# EAGLE design flow_sensor (EAGLE 8.4.3)

## Sheet 1 of 2
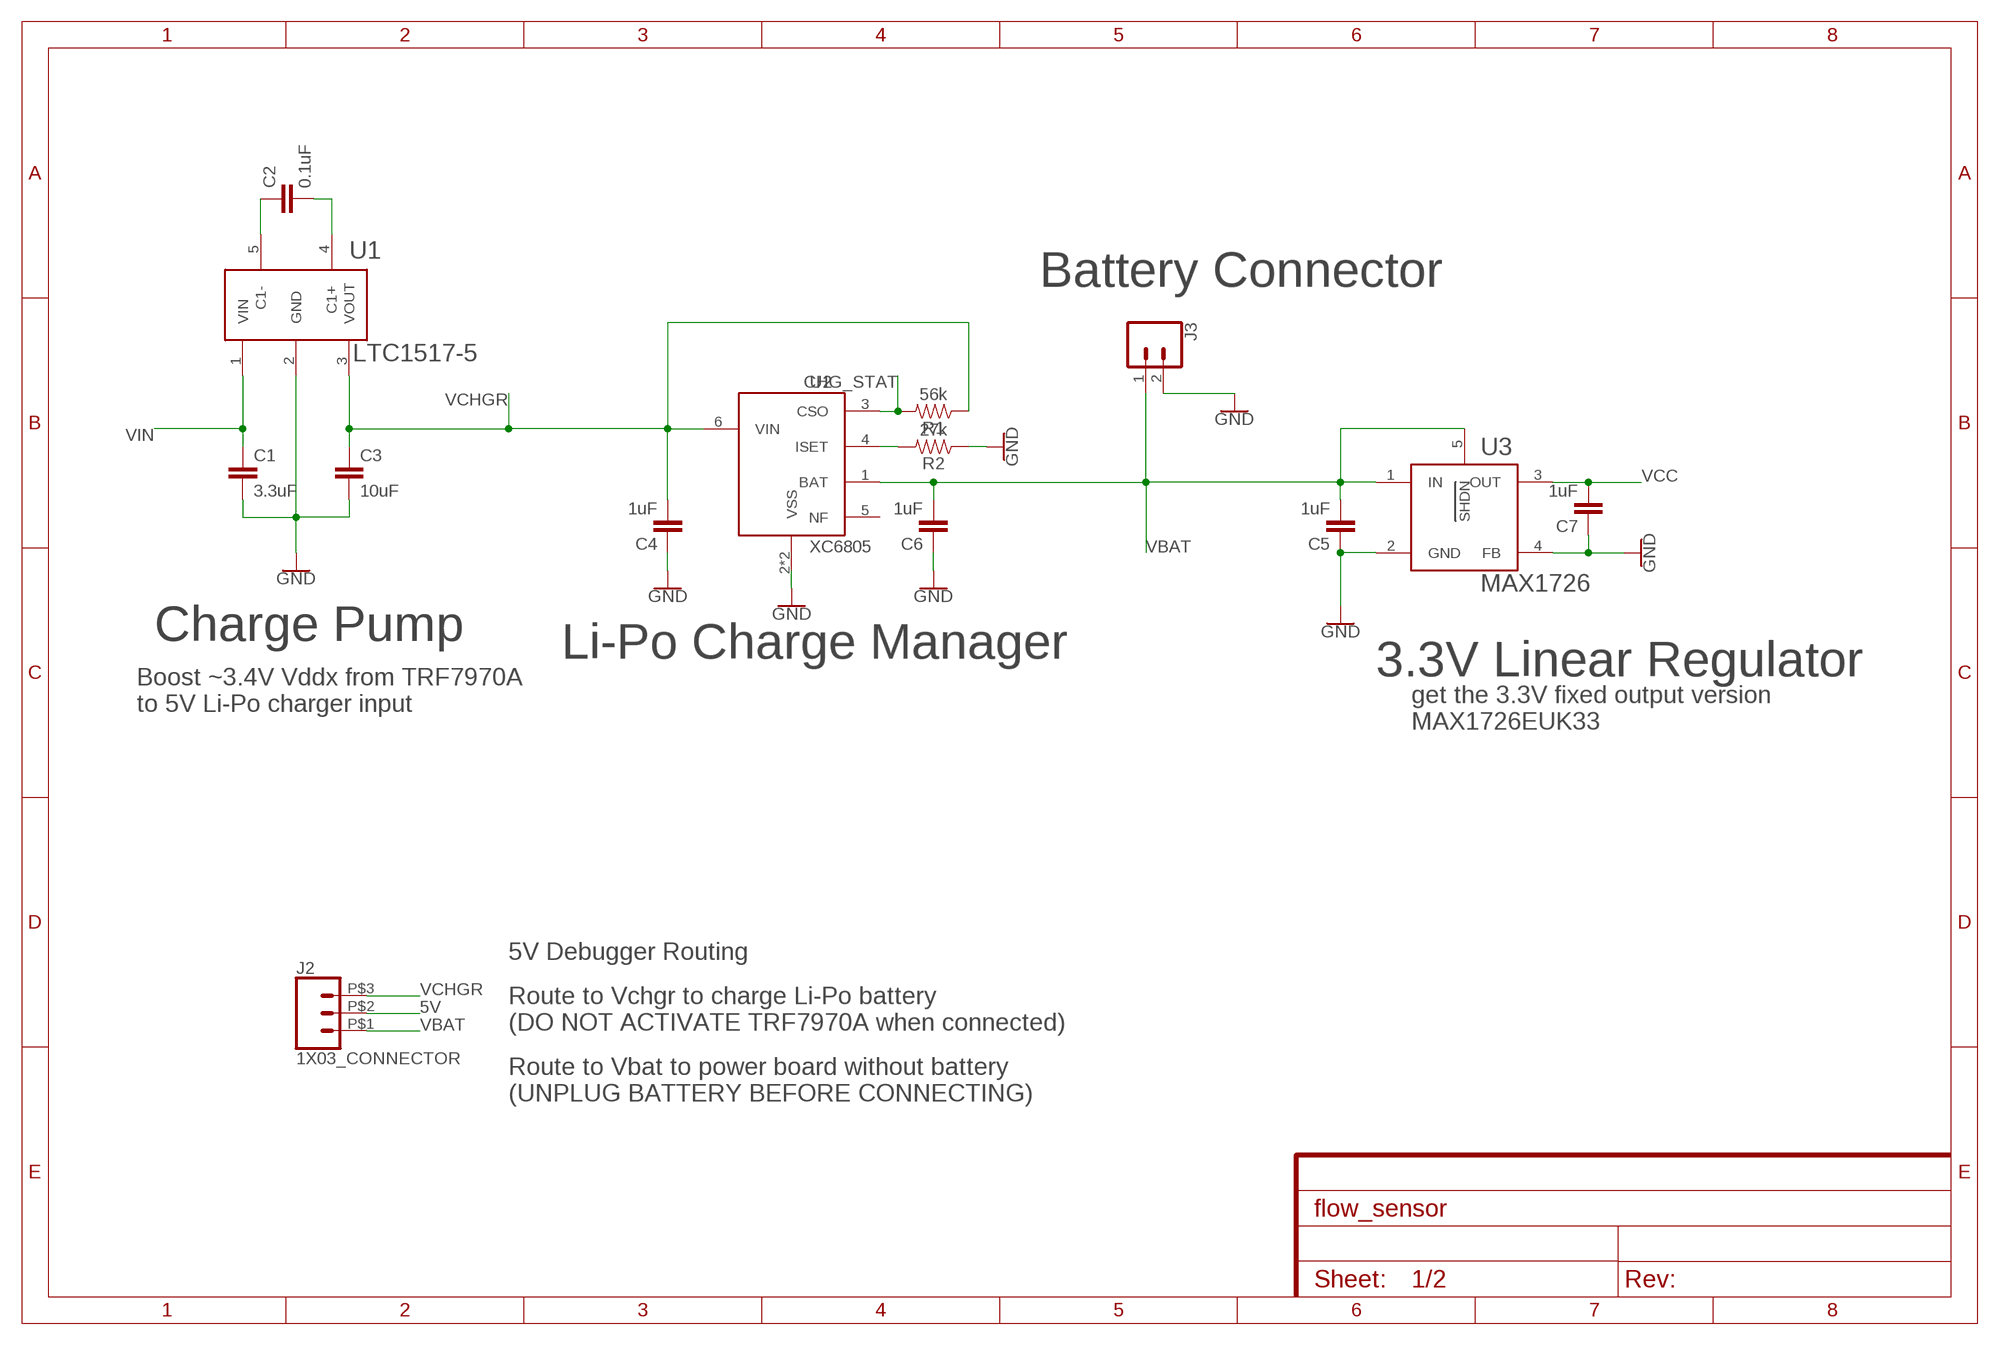
[diagram p0: schematic, sheet 1, part 1 of 2]
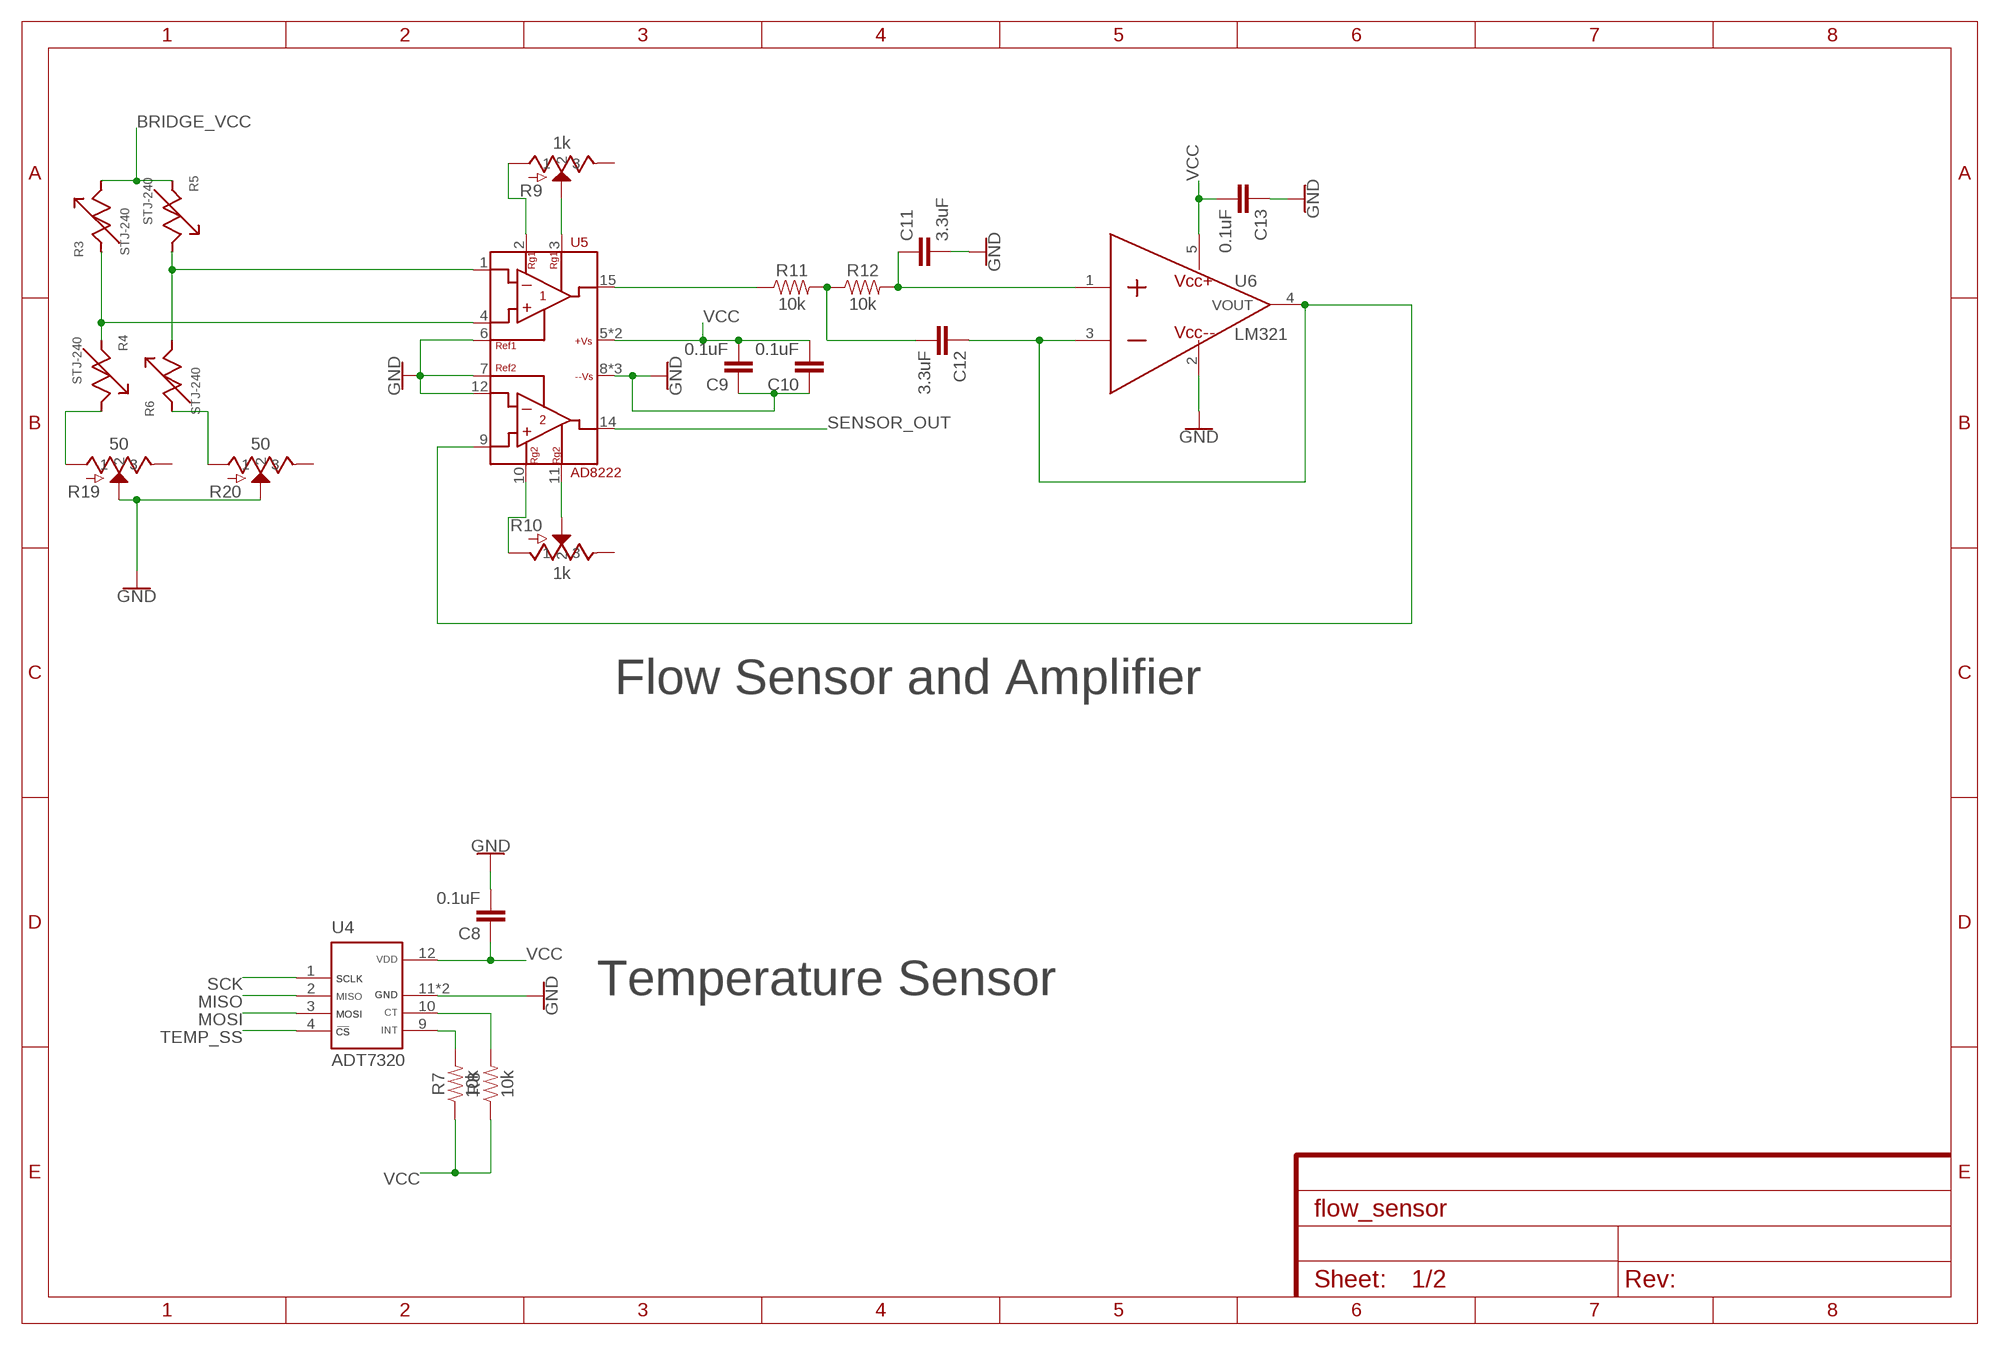
[diagram p1: schematic, sheet 1, part 2 of 2]
FRAME1 (FRAME-A4L): CNAME: Power Supply; DESIGNER: A Osborn, M Silvern, N Yokley
FRAME2 (FRAME-A4L): CNAME: Sensor; DESIGNER: A Osborn, M Silvern, N Yokley

### Parts
C1  3.3uF  CAPACITOR_NONPOLARIZED  [0603]
C2  0.1uF  CAPACITOR_NONPOLARIZED  [0603]
C3  10uF  CAPACITOR_NONPOLARIZED  [0603]
C4  1uF  CAPACITOR_NONPOLARIZED  [0603]
C5  1uF  CAPACITOR_NONPOLARIZED  [0603]
C6  1uF  CAPACITOR_NONPOLARIZED  [0603]
C7  1uF  CAPACITOR_NONPOLARIZED  [0603]
C8  0.1uF  CAPACITOR_NONPOLARIZED  [0603]
C9  0.1uF  CAPACITOR_NONPOLARIZED  [0603]
C10  0.1uF  CAPACITOR_NONPOLARIZED  [0603]
C11  3.3uF  CAPACITOR_NONPOLARIZED  [0603]
C12  3.3uF  CAPACITOR_NONPOLARIZED  [0603]
C13  0.1uF  CAPACITOR_NONPOLARIZED  [0603]
J2  1X03_CONNECTOR  [1X03_SMD_HEADER]
J3  CONN_021X02_NO_SILK  [1X02_NO_SILK]
R1  56k  RESISTOR  [0603]
R2  27k  RESISTOR  [0603]
R3  STJ-240  [SOIC-8-NOCREAM]
R4  STJ-240  [SOIC-8-NOCREAM]
R5  STJ-240  [SOIC-8-NOCREAM]
R6  STJ-240  [SOIC-8-NOCREAM]
R7  10k  RESISTOR  [0603]
R8  10k  RESISTOR  [0603]
R9  1k  ST-32ETA  [ST-32ETA]
R10  1k  ST-32ETA  [ST-32ETA]
R11  10k  RESISTOR  [0603]
R12  10k  RESISTOR  [0603]
R19  50  ST-32ETA  [ST-32ETA]
R20  50  ST-32ETA  [ST-32ETA]
U1  LTC1517-5  [SOT-23-5]
U2  XC6805  [DFN6-1.8X2.0]
U3  MAX1726  [SOT-23-5]
U4  ADT7320  [QFN16-4X4]
U5  AD8222  [QFN16-4X4]
U6  LM321  [SOT-23-5]

### Nets
5V: J2.P$2 ; also sheet 2
BRIDGE_VCC: R3.8 R5.1 ; also sheet 2
CHG_STAT: R1.2 U2.3(CSO) ; also sheet 2
GND: C1.2 C3.2 C4.1 C5.1 C6.1 C7.1 C8.2 C9.1 C10.1 C11.2 C13.1 J3.2 R2.1 R19.2 R20.2 U1.2(GND) U2.2(VSS) U2.PAD(VSS) U3.2(GND) U3.4(FB) U4.11(GND) U4.EXP(GND) U5.6(REF1) U5.7(REF2) U5.8(-VS) U5.12(-IN2) U5.13(-VS) U5.EXP(-VS) U6.2(VCC-) ; also sheet 2
MISO: U4.2(MISO) ; also sheet 2
MOSI: U4.3(MOSI) ; also sheet 2
N$2: C2.1 U1.5(C1-)
N$3: C2.2 U1.4(C1+)
N$5: R4.8 R19.1
N$6: R7.2 U4.9(INT)
N$7: R6.1 R20.1
N$17: R10.1 U5.10(RG2)
N$18: R3.1 R4.1 U5.4(+IN1)
N$19: C11.1 R12.2 U6.1(IN+)
N$21: C12.1 U5.9(+IN2) U6.3(IN-) U6.4(VOUT)
N$22: R9.1 U5.2(RG1)
N$23: R10.2 U5.11(RG2')
N$26: R8.2 U4.10(CT)
N$27: R9.2 U5.3(RG1')
N$29: R5.8 R6.8 U5.1(-IN1)
N$36: C12.2 R11.2 R12.1
N$39: R2.2 U2.4(ISET)
N$43: R11.1 U5.15(OUT1)
SCK: U4.1(SCLK) ; also sheet 2
SENSOR_OUT: U5.14(OUT2) ; also sheet 2
TEMP_SS: U4.4(CS) ; also sheet 2
VBAT: C5.2 C6.2 J2.P$1 J3.1 U2.1(BAT) U3.1(IN) U3.5(SHDN) ; also sheet 2
VCC: C7.2 C8.1 C9.2 C10.2 C13.2 R7.1 R8.1 U3.3(OUT) U4.12(VDD) U5.5(+VS) U5.16(+VS) U6.5(VCC+) ; also sheet 2
VCHGR: C3.1 C4.2 J2.P$3 R1.1 U1.3(VOUT) U2.6(VIN)
VIN: C1.1 U1.1(VIN) ; also sheet 2
Unconnected: R9.3 R10.3 R19.3 R20.3 U2.5(NF)

### Notes on the sheet
- Battery Connector
- Charge Pump
- Li-Po Charge Manager
- 3.3V Linear Regulator
- Flow Sensor and Amplifier
- Boost ~3.4V Vddx from TRF7970A
  to 5V Li-Po charger input
- get the 3.3V fixed output version
  MAX1726EUK33
- 5V Debugger Routing
- Temperature Sensor
- Route to Vchgr to charge Li-Po battery
  (DO NOT ACTIVATE TRF7970A when connected)
- Route to Vbat to power board without battery
  (UNPLUG BATTERY BEFORE CONNECTING)

## Sheet 2 of 2
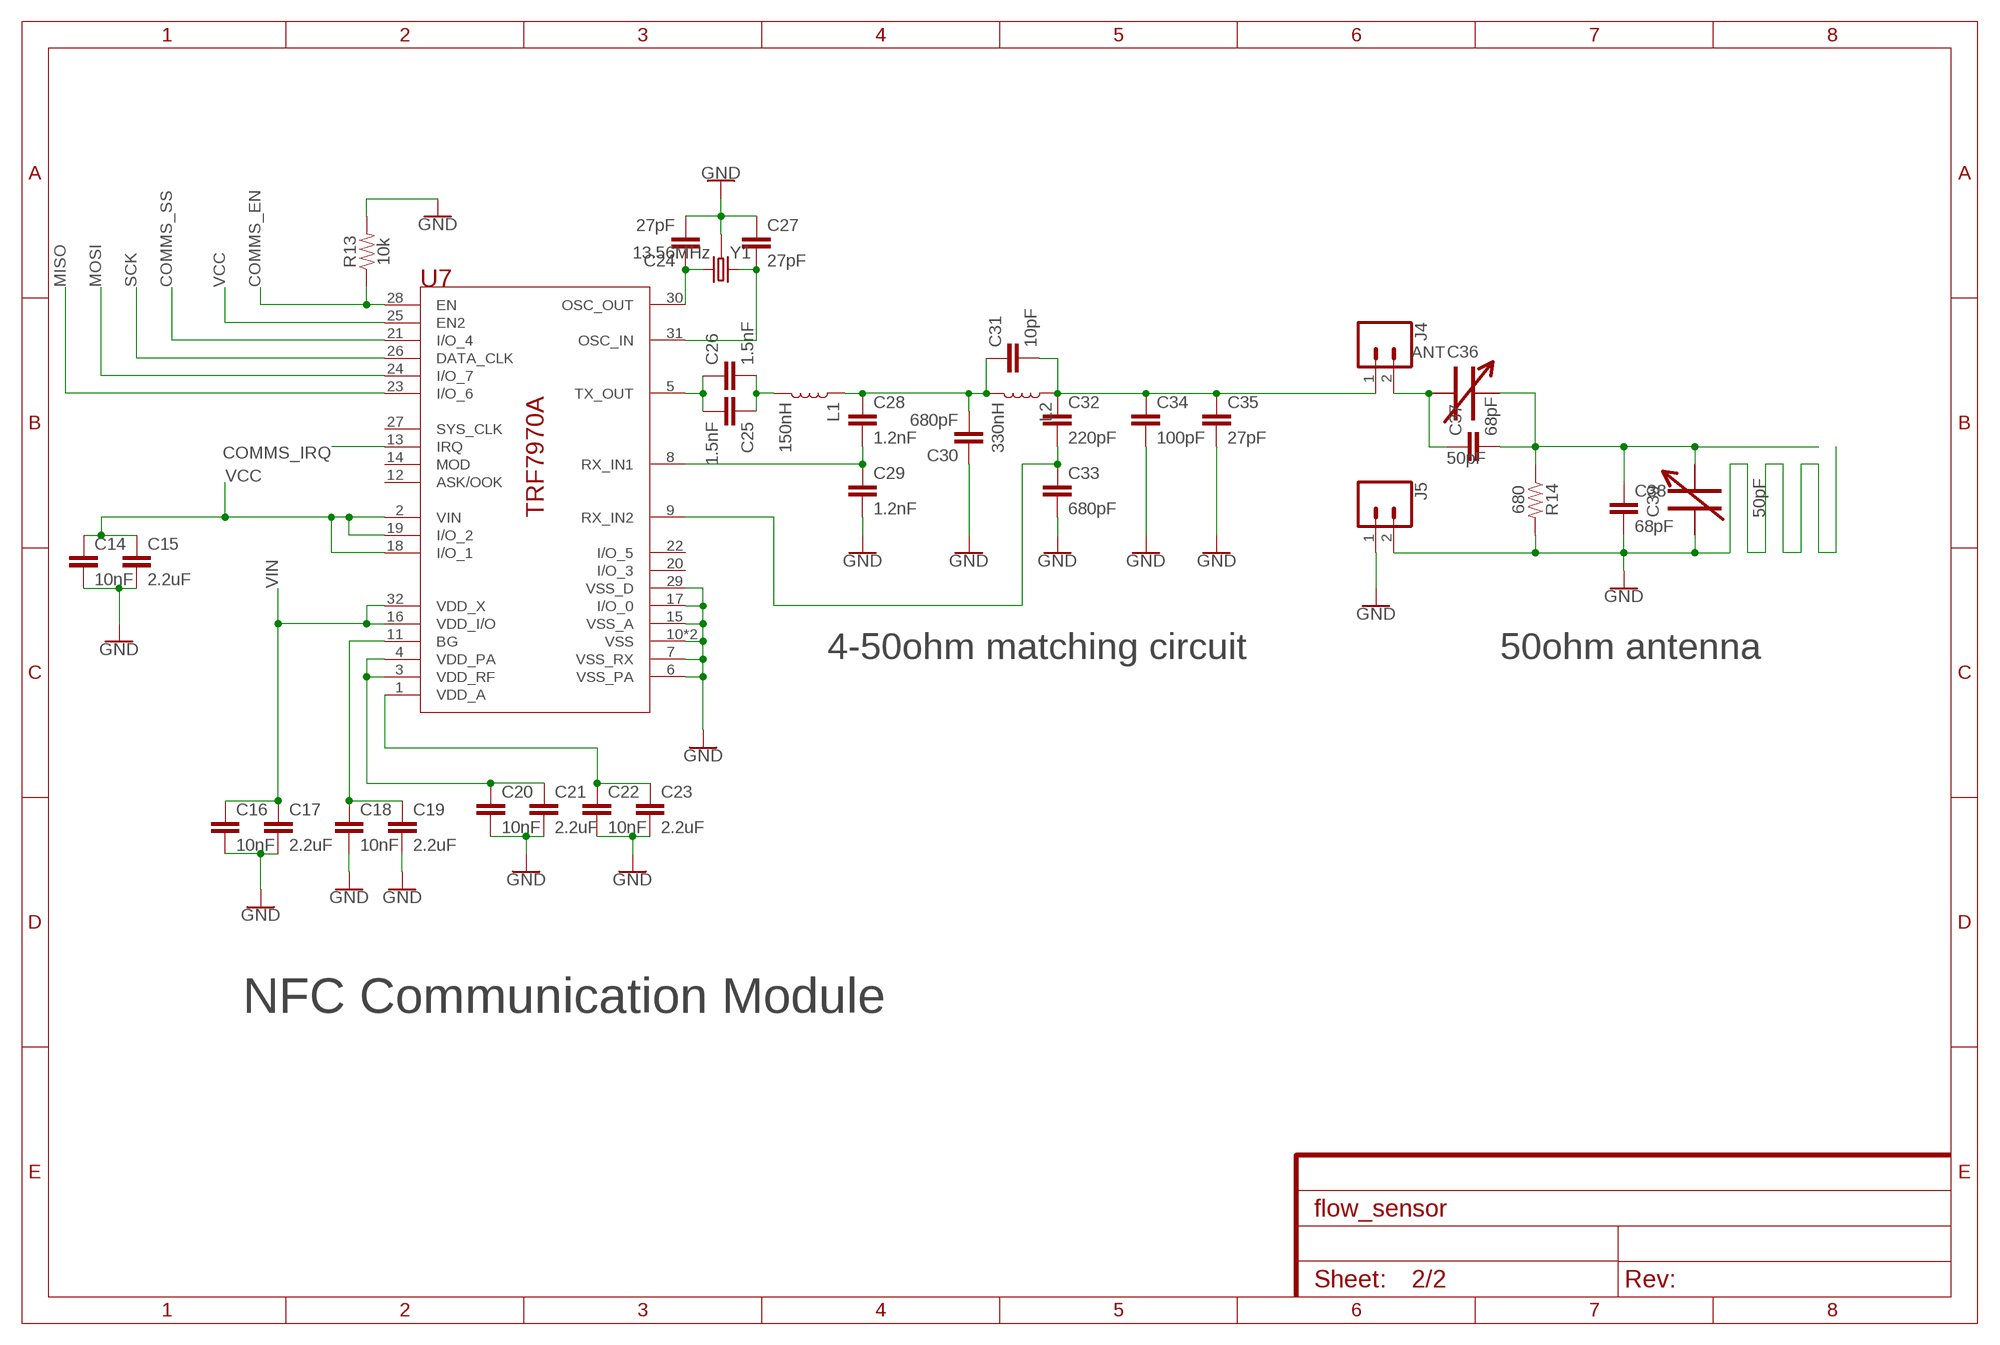
[diagram p2: schematic, sheet 2, part 1 of 2]
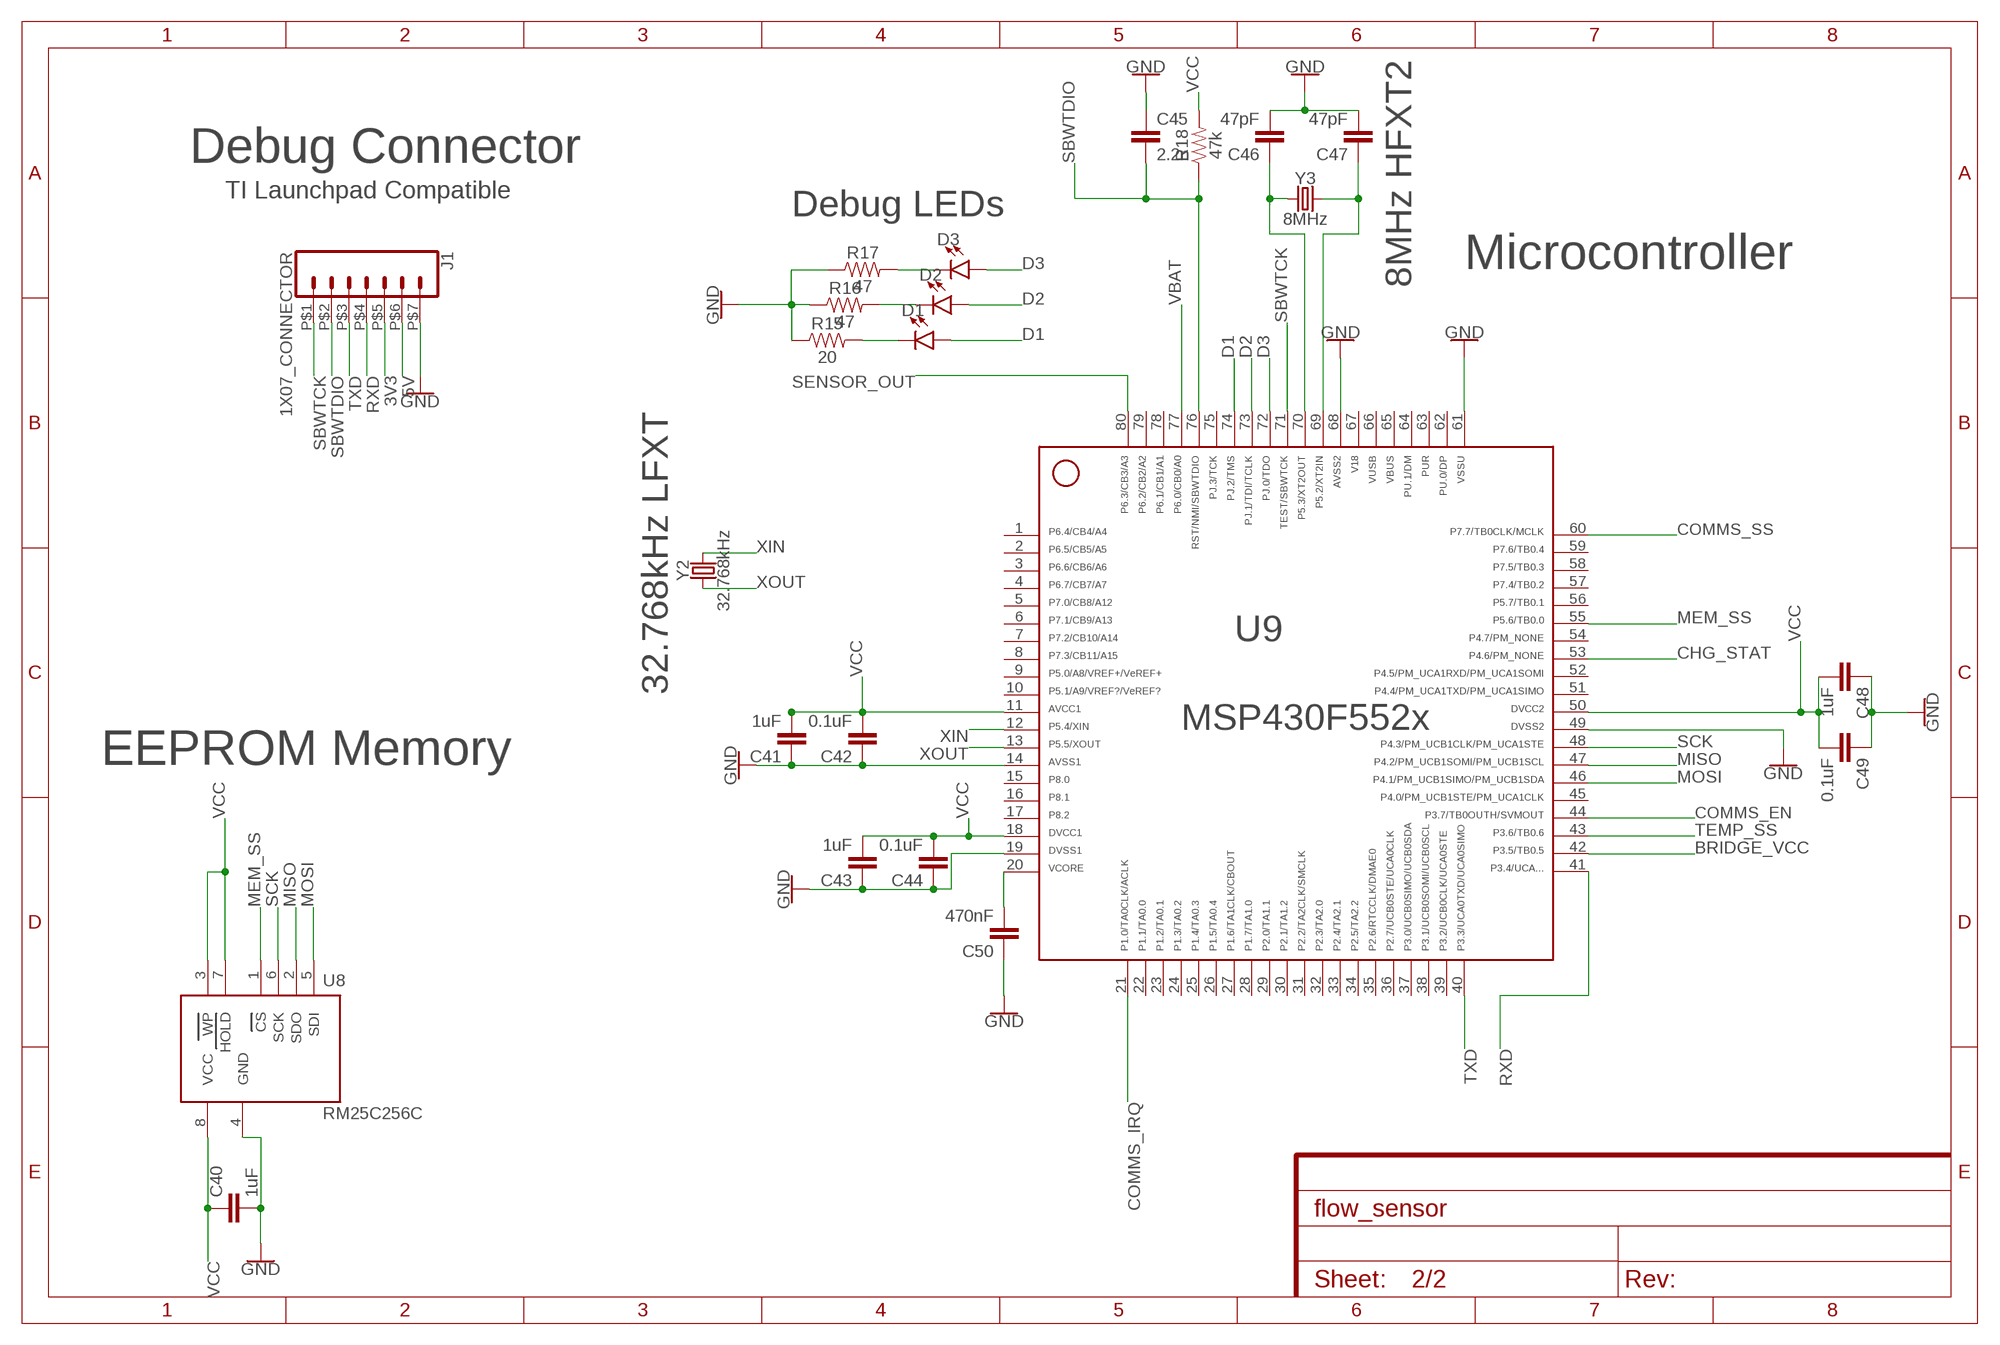
[diagram p3: schematic, sheet 2, part 2 of 2]
FRAME3 (FRAME-A4L): CNAME: Communications; DESIGNER: A Osborn, M Silver, N Yokley
FRAME4 (FRAME-A4L): CNAME: Microcontroller; DESIGNER: A Osborn, M Silver, N Yokley

### Parts
C14  10nF  CAPACITOR_NONPOLARIZED  [0603]
C15  2.2uF  CAPACITOR_NONPOLARIZED  [0603]
C16  10nF  CAPACITOR_NONPOLARIZED  [0603]
C17  2.2uF  CAPACITOR_NONPOLARIZED  [0603]
C18  10nF  CAPACITOR_NONPOLARIZED  [0603]
C19  2.2uF  CAPACITOR_NONPOLARIZED  [0603]
C20  10nF  CAPACITOR_NONPOLARIZED  [0603]
C21  2.2uF  CAPACITOR_NONPOLARIZED  [0603]
C22  10nF  CAPACITOR_NONPOLARIZED  [0603]
C23  2.2uF  CAPACITOR_NONPOLARIZED  [0603]
C24  27pF  CAPACITOR_NONPOLARIZED  [0603]
C25  1.5nF  CAPACITOR_NONPOLARIZED  [0603]
C26  1.5nF  CAPACITOR_NONPOLARIZED  [0603]
C27  27pF  CAPACITOR_NONPOLARIZED  [0603]
C28  1.2nF  CAPACITOR_NONPOLARIZED  [0603]
C29  1.2nF  CAPACITOR_NONPOLARIZED  [0603]
C30  680pF  CAPACITOR_NONPOLARIZED  [0603]
C31  10pF  CAPACITOR_NONPOLARIZED  [0603]
C32  220pF  CAPACITOR_NONPOLARIZED  [0603]
C33  680pF  CAPACITOR_NONPOLARIZED  [0603]
C34  100pF  CAPACITOR_NONPOLARIZED  [0603]
C35  27pF  CAPACITOR_NONPOLARIZED  [0603]
C36  50pF  TZY2_TRIM_CAP  [TZY2_TRIM_CAP]
C37  68pF  C2.5/2  [C2.5-2]
C38  68pF  C2.5/2  [C2.5-2]
C39  50pF  TZY2_TRIM_CAP  [TZY2_TRIM_CAP]
C40  1uF  CAPACITOR_NONPOLARIZED  [0603]
C41  1uF  CAPACITOR_NONPOLARIZED  [0603]
C42  0.1uF  CAPACITOR_NONPOLARIZED  [0603]
C43  1uF  CAPACITOR_NONPOLARIZED  [0603]
C44  0.1uF  CAPACITOR_NONPOLARIZED  [0603]
C45  2.2n  CAPACITOR_NONPOLARIZED  [0603]
C46  47pF  CAPACITOR_NONPOLARIZED  [0603]
C47  47pF  CAPACITOR_NONPOLARIZED  [0603]
C48  1uF  CAPACITOR_NONPOLARIZED  [0603]
C49  0.1uF  CAPACITOR_NONPOLARIZED  [0603]
C50  470nF  CAPACITOR_NONPOLARIZED  [0603]
D1  LED0603  [LED-0603]
D2  LED0603  [LED-0603]
D3  LED0603  [LED-0603]
J1  1X07_CONNECTOR  [1X07_SMD_HEADER]
J4  CONN_02  [1X02]
J5  CONN_02  [1X02]
L1  150nH  INDUCTOR  [0603]
L2  330nH  INDUCTOR  [0603]
R13  10k  RESISTOR  [0603]
R14  680  RESISTOR  [0603]
R15  20  RESISTOR  [0603]
R16  47  RESISTOR  [0603]
R17  47  RESISTOR  [0603]
R18  47k  RESISTOR  [0603]
U7  TRF7970A  [QFN-32]
U8  RM25C256C  [DFN8-2X3]
U9  F552X---PN80  [PN80]
Y1  13.56MHz  CRYSTAL-GROUNDEDSMD-3.2X2.5  [CRYSTAL-SMD-3.2X2.5MM]
Y2  32.768kHz  CRYSTAL-3.2X1.5  [CRYSTAL-3.2X1.5]
Y3  8MHz  CRYSTAL-3.2X2.5  [CRYSTAL-3.2X2.5]

### Nets
3V3: J1.P$5
5V: J1.P$6 ; also sheet 1
ANT: C31.2 C32.1 C34.1 C35.1 J4.1 L2.1
BRIDGE_VCC: U9.42 ; also sheet 1
CHG_STAT: U9.53 ; also sheet 1
COMMS_EN: R13.1 U7.28(EN) U9.44
COMMS_IRQ: U7.13(IRQ) U9.21
COMMS_SS: U7.21(I/O_4) U9.60
D1: D1.A U9.74
D2: D2.A U9.73
D3: D3.A U9.72
GND: C14.2 C15.2 C16.2 C17.2 C18.2 C19.2 C20.2 C21.2 C22.2 C23.2 C24.2 C27.1 C29.2 C30.1 C33.2 C34.2 C35.2 C38.2 C39.P$1 C40.2 C41.1 C42.1 C43.1 C44.1 C45.1 C46.2 C47.2 C48.1 C49.1 C50.1 J1.P$7 J5.1 J5.2 R13.2 R14.2 R15.1 R16.1 R17.1 U7.6(VSS_PA) U7.7(VSS_RX) U7.10(VSS) U7.15(VSS_A) U7.17(I/O_0) U7.29(VSS_D) U7.EP(VSS) U8.4(GND) U9.14 U9.19 U9.49 U9.61 U9.68 Y1.2 Y1.4 ; also sheet 1
MEM_SS: U8.1(CS) U9.55
MISO: U7.23(I/O_6) U8.2(SDO) U9.47 ; also sheet 1
MOSI: U7.24(I/O_7) U8.5(SDI) U9.46 ; also sheet 1
N$1: D2.C R16.2
N$4: C24.1 U7.30(OSC_OUT) Y1.3
N$8: C18.1 C19.1 U7.11(BG)
N$9: C20.1 C21.1 U7.3(VDD_RF) U7.4(VDD_PA)
N$10: C27.2 U7.31(OSC_IN) Y1.1
N$11: C22.1 C23.1 U7.1(VDD_A)
N$12: C25.2 C26.1 U7.5(TX_OUT)
N$13: C28.1 C30.2 C31.1 L1.1 L2.2
N$14: C28.2 C29.1 U7.8(RX_IN1)
N$15: C25.1 C26.2 L1.2
N$16: C32.2 C33.1 U7.9(RX_IN2)
N$20: C36.P$2 C37.2 C38.1 C39.P$2 R14.1
N$25: C36.P$1 C37.1 J4.2
N$28: C47.1 U9.69 Y3.2
N$30: C46.1 U9.70 Y3.1
N$32: C50.2 U9.20
N$34: D3.C R17.2
N$38: D1.C R15.2
RXD: J1.P$4 U9.41
SBWTCK: J1.P$1 U9.71
SBWTDIO: C45.2 J1.P$2 R18.1 U9.76
SCK: U7.26(DATA_CLK) U8.6(SCK) U9.48 ; also sheet 1
SENSOR_OUT: U9.80 ; also sheet 1
TEMP_SS: U9.43 ; also sheet 1
TXD: J1.P$3 U9.40
VBAT: U9.77 ; also sheet 1
VCC: C14.1 C15.1 C40.1 C41.2 C42.2 C43.2 C44.2 C48.2 C49.2 R18.2 U7.2(VIN) U7.18(I/O_1) U7.19(I/O_2) U7.25(EN2) U8.3(WP) U8.7(HOLD) U8.8(VCC) U9.11 U9.18 U9.50 ; also sheet 1
VIN: C16.1 C17.1 U7.16(VDD_I/O) U7.32(VDD_X) ; also sheet 1
XIN: U9.12 Y2.P$2
XOUT: U9.13 Y2.P$1
Unconnected: U7.12(ASK/OOK) U7.14(MOD) U7.20(I/O_3) U7.22(I/O_5) U7.27(SYS_CLK) U9.1 U9.2 U9.3 U9.4 U9.5 U9.6 U9.7 U9.8 U9.9 U9.10 U9.15 U9.16 U9.17 U9.22 U9.23 U9.24 U9.25 U9.26 U9.27 U9.28 U9.29 U9.30 U9.31 U9.32 U9.33 U9.34 U9.35 U9.36 U9.37 U9.38 U9.39 U9.45 U9.51 U9.52 U9.54 U9.56 U9.57 U9.58 U9.59 U9.62 U9.63 U9.64 U9.75 U9.78 U9.79

### Notes on the sheet
- Debug Connector
- TI Launchpad Compatible
- Debug LEDs
- Microcontroller
- 8MHz HFXT2
- 4-50ohm matching circuit | 50ohm antenna
- 32.768kHz LFXT
- EEPROM Memory
- NFC Communication Module

## Power pins joined to a net without a drawn wire
65: U9.65
66: U9.66
67: U9.67

## Library data of the parts
C1-C35 C40-C50 = my_library:CAPACITOR_NONPOLARIZED
C36 C39 = my_library:TZY2_TRIM_CAP
C37 C38 = capacitor-wima:C: CAPACITOR naming: grid - package width
D1-D3 = SparkFun-LED:LED: LED (Generic) Standard schematic elements and footprints for 5mm, 3mm, 1206, and 0603 sized LEDs. Generic LEDs with no color specified.
J1 = my_library:1X07_CONNECTOR
J2 = my_library:1X03_CONNECTOR
J3-J5 = SparkFun-Connectors:CONN_02: Multi connection point. Often used as Generic Header-pin footprint for 0.1 inch spaced/style header connections On any of the 0.1 inch spaced packages, you can populate with these: Break Away Headers - Straight <https://www.sparkfun.com/products/116> (PRT-00116) Break Away Male Headers - Right Angle <https://www.sparkfun.com/products/553> (PRT-00553) Female Headers <https://www.sparkfun.com/products/115> (PRT-00115) Break Away Headers - Machine Pin <https://www.sparkfun.com/products/117> (PRT-00117) Break Away Female Headers - Swiss Machine Pin <https://www.sparkfun.com/products/743> (PRT-00743) For SCREWTERMINALS and SPRING TERMINALS visit here: Screw Terimnals on SparkFun.com <https://www.sparkfun.com/search/results?term=Screw+Terminals> (5mm/3.5mm/2.54mm spacing) This device is also useful as a general connection point to wire up your design to another part of your project. Our various solder wires solder well into these plated through hole pads. Hook-Up Wire - Assortment (Stranded, 22 AWG) <https://www.sparkfun.com/products/11375> (PRT-11375) Hook-Up Wire - Assortment (Solid Core, 22 AWG) <https://www.sparkfun.com/products/11367> (PRT-11367) View the entire wire category on our website here <https://www.sparkfun.com/categories/141> Special notes: Molex polarized connector foot print use with: PRT-08233 with associated crimp pins and housings. 2.54_SCREWTERM for use with PRT-10571. 3.5mm Screw Terminal footprints for PRT-08084 5mm Screw Terminal footprints for use with PRT-08432
L1 L2 = my_library:INDUCTOR
R1 R2 R7 R8 R11-R18 = my_library:RESISTOR
R3-R6 = my_library:STJ-240
R9 R10 R19 R20 = my_library:ST-32ETA
U1 = my_library:LTC1517-5: Micropower, Regulated 5V Charge Pump. 5V+/-4% Regulated Output. Vin: 2.7V-5V
U2 = my_library:XC6805: Single-Cell Li-ion/Li-polymer Linear Charger IC - Vin:4.5-6V - Iq:100uA - Icc: 5-40mA - Vcv: 4.2V, 4.05V(at high temperature)
U3 = my_library:MAX1726
U4 = my_library:ADT7320
U5 = my_library:AD8222: Precision, Dual-Channel Instrumentation Amplifier
U6 = my_library:LM321: Low-power, general-purpose operational amplifier 2.7V-5.7V Supply STMicroelectronics: http://www.st.com/content/ccc/resource/technical/document/datasheet/fa/2c/e4/1d/5f/74/45/2a/DM00052423.pdf/files/DM00052423.pdf/jcr:content/translations/en.DM00052423.pdf Digikey: https://www.digikey.com/product-detail/en/stmicroelectronics/LMV321LICT/497-13050-2-ND/3458190
U7 = my_library:TRF7970A: Multi-Protocol Fully Integrated 13.56-MHz NFC / RFID Transceiver IC
U8 = my_library:RM25C256C
U9 = my_library:F552X---PN80: ***MSP430F552X***PN80 http://www.ti.com/lit/gpn/msp430f5529 Rev1.0 06/2010 For F552X where X is 1,5,7,9
Y1 = SparkFun-Clocks:CRYSTAL-GROUNDED: Crystals w/ Ground Pin (Generic) These are passive quartz crystals, which can be used as a clock source for a microcontroller. Crystal's are usually two-terminal devices. A third terminal may be optionally connected to ground, as recommended by the manufaturer.
Y2 = my_library:CRYSTAL-3.2X1.5
Y3 = my_library:CRYSTAL-3.2X2.5

## Board
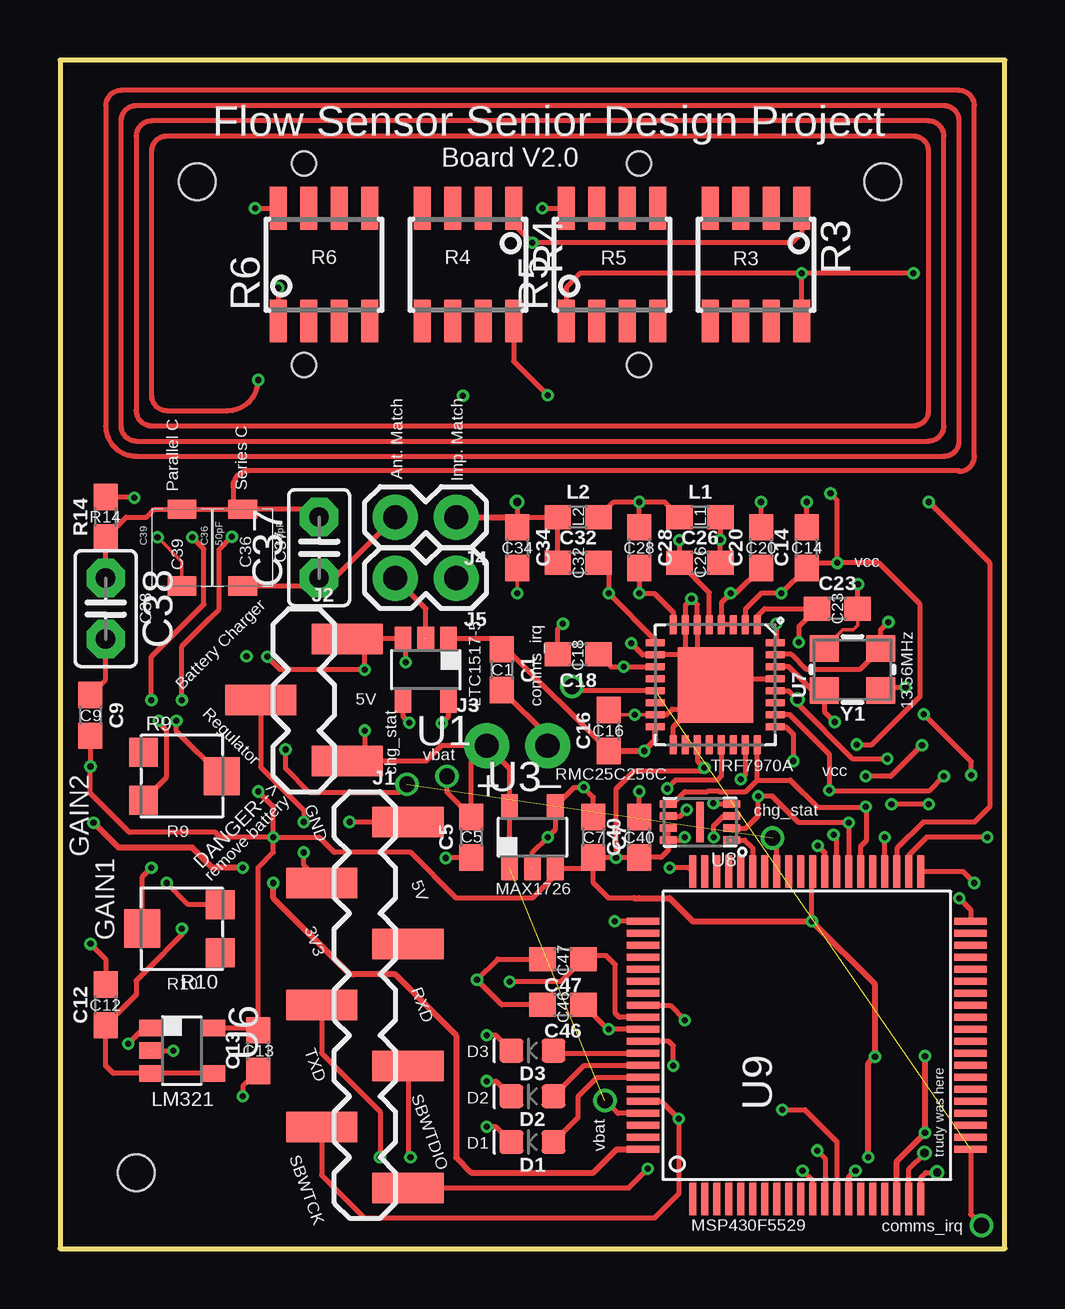
[diagram p4: board, top side]
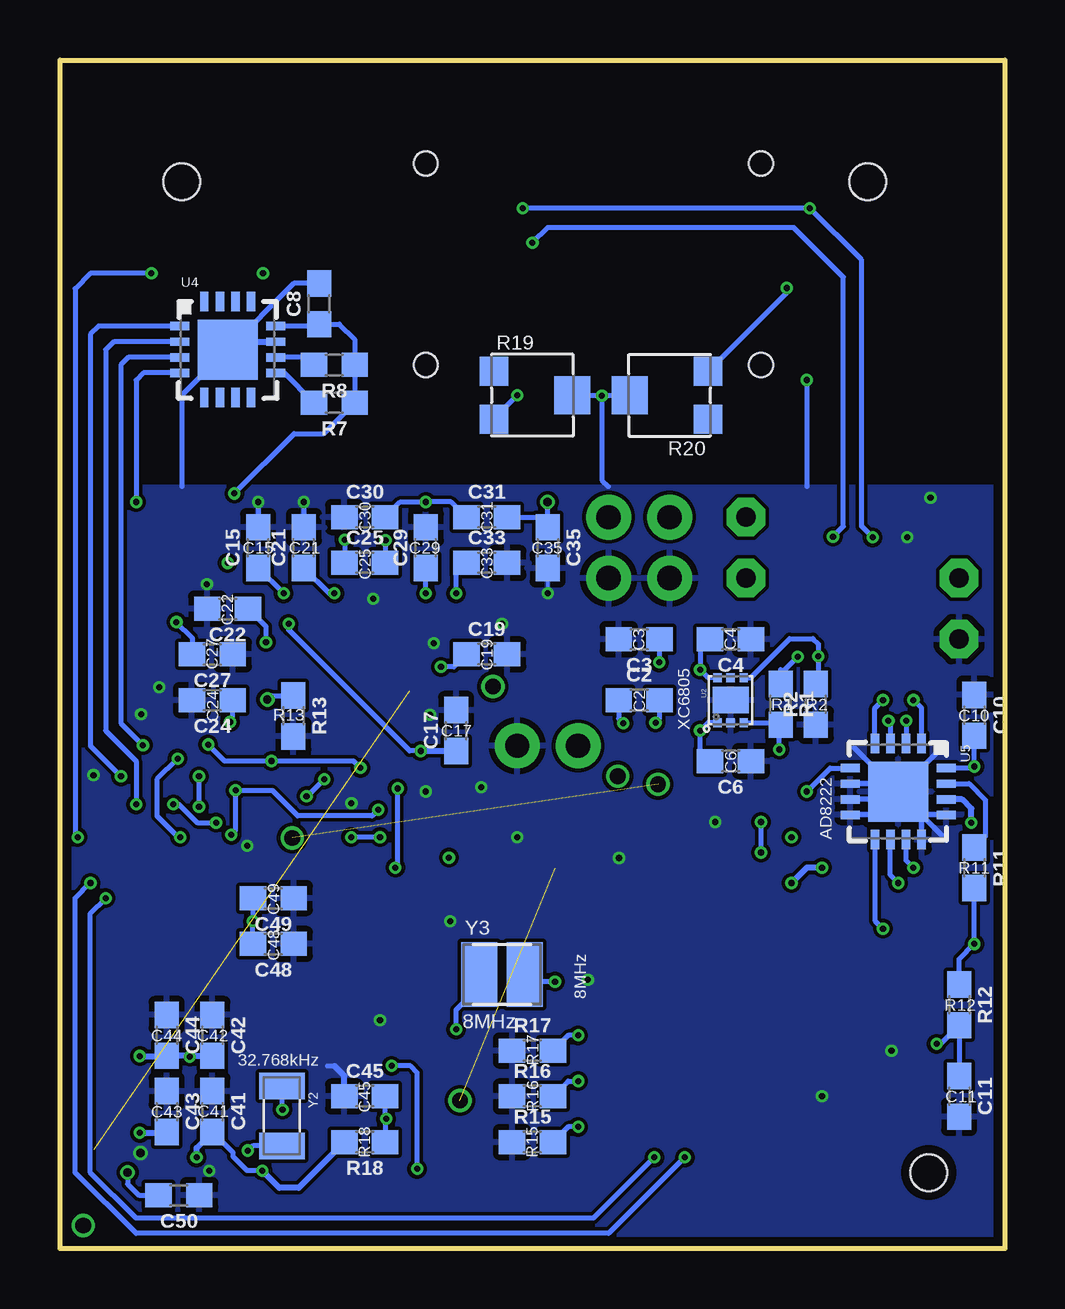
[diagram p5: board, bottom side, seen from below]

Size 39.37 x 49.53 mm. Coordinates in mm from the lower left corner, seen from the top.
Outline: 0,0 39.37,0 39.37,49.53 0,49.53 0,0
Copper layers (1*16): Top 0.035559375mm / dielectric 1.6mm / Bottom 0.035559375mm
Design rules "oshpark-2layer": minimum track width 6mil, minimum drill 10mil, track to track 6mil, track to pad 6mil, pad to pad 6mil, via to via 6mil, smd to smd 6mil, copper to edge 15mil, drill to drill 6mil, minimum pad ring 5mil, minimum via ring 5mil, stop-mask expansion 2.5mil, vias tented up to drill 0mil, thermal gap 10mil
Holes 1 mm at 10.16,36.83 10.16,45.21 24.13,36.83 24.13,45.21
Holes 1.52 mm at 5.71,44.45 34.29,44.45 3.17,3.17

### Footprints (pad centres in the part's own frame; a part is rotated, then mirrored left to right if it is on the bottom)
0603 = smd 1.1 x 1: 1 -0.85,0; 2 0.85,0
TZY2_TRIM_CAP = smd 0.8 x 1.2: P$1 -1.6,0; P$2 1.6,0
C2.5-2 = drill 0.813 pad 1.6 octagon: 1 -1.27,0; 2 1.27,0
LED-0603 = smd 1 x 1: A -0.877,0; C 0.877,0
1X07_SMD_HEADER = smd 1.27 x 2.96: P$1 0,-1.8; P$2 2.54,1.8; P$3 5.08,-1.8; P$4 7.62,1.8; P$5 10.16,-1.8; P$6 12.7,1.8; P$7 15.24,-1.8
1X03_SMD_HEADER = smd 1.27 x 2.96: P$1 0,-1.8; P$2 2.54,1.8; P$3 5.08,-1.8
1X02_NO_SILK = drill 1.016 pad 1.88: 1 0,0; 2 2.54,0
1X02 = drill 1.016 pad 1.88: 1 0,0; 2 2.54,0
SOIC-8-NOCREAM = smd 0.72 x 1.78: 1 -1.905,-2.35; 2 -0.635,-2.35; 3 0.635,-2.35; 4 1.905,-2.35; 5 1.905,2.35; 6 0.635,2.35; 7 -0.635,2.35; 8 -1.905,2.35
ST-32ETA = smd 1.2 x 1.2: 1 1,-1.6; 3 -1,-1.6 | smd 1.6 x 1.5: 2 0,1.65
SOT-23-5 = smd 0.69 x 0.99: 1 -0.95,-1.29; 2 0,-1.29; 3 0.95,-1.29; 4 0.95,1.3; 5 -0.95,1.3
DFN6-1.8X2.0 = smd 0.35 x 0.375: 1 -0.55,-0.938; 2 0,-0.938; 3 0.55,-0.938; 4 0.55,0.938; 5 0,0.938; 6 -0.55,0.938 | smd 1.5 x 1.1: PAD 0,0
QFN16-4X4 = smd 0.8 x 0.35: 1 -2,0.975; 2 -2,0.325; 3 -2,-0.325; 4 -2,-0.975; 9 2,-0.975; 10 2,-0.325; 11 2,0.325; 12 2,0.975 | smd 0.35 x 0.8: 5 -0.975,-2; 6 -0.325,-2; 7 0.325,-2; 8 0.975,-2; 13 0.975,2; 14 0.325,2; 15 -0.325,2; 16 -0.975,2 | smd 2.5 x 2.5: EXP 0,0
QFN-32 = smd 0.285 x 0.8: 1 -1.75,-2.5; 2 -1.25,-2.5; 3 -0.75,-2.5; 4 -0.25,-2.5; 5 0.25,-2.5; 6 0.75,-2.5; 7 1.25,-2.5; 8 1.75,-2.5; 17 1.75,2.5; 18 1.25,2.5; 19 0.75,2.5; 20 0.25,2.5; 21 -0.25,2.5; 22 -0.75,2.5; 23 -1.25,2.5; 24 -1.75,2.5 | smd 0.8 x 0.285: 9 2.5,-1.75; 10 2.5,-1.25; 11 2.5,-0.75; 12 2.5,-0.25; 13 2.5,0.25; 14 2.5,0.75; 15 2.5,1.25; 16 2.5,1.75; 25 -2.5,1.75; 26 -2.5,1.25; 27 -2.5,0.75; 28 -2.5,0.25; 29 -2.5,-0.25; 30 -2.5,-0.75; 31 -2.5,-1.25; 32 -2.5,-1.75 | smd 3.15 x 3.15: EP 0,0
DFN8-2X3 = smd 0.7 x 0.3: 1 -1.325,0.75; 2 -1.325,0.25; 3 -1.325,-0.25; 4 -1.325,-0.75; 5 1.325,-0.75; 6 1.325,-0.25; 7 1.325,0.25; 8 1.325,0.75 | smd 0.3 x 1.7: EXP 0,0
PN80 = smd 1.35 x 0.3: 1 -6.825,4.75; 2 -6.825,4.25; 3 -6.825,3.75; 4 -6.825,3.25; 5 -6.825,2.75; 6 -6.825,2.25; 7 -6.825,1.75; 8 -6.825,1.25; 9 -6.825,0.75; 10 -6.825,0.25; 11 -6.825,-0.25; 12 -6.825,-0.75; 13 -6.825,-1.25; 14 -6.825,-1.75; 15 -6.825,-2.25; 16 -6.825,-2.75; 17 -6.825,-3.25; 18 -6.825,-3.75; 19 -6.825,-4.25; 20 -6.825,-4.75; 41 6.825,-4.75; 42 6.825,-4.25; 43 6.825,-3.75; 44 6.825,-3.25; 45 6.825,-2.75; 46 6.825,-2.25; 47 6.825,-1.75; 48 6.825,-1.25; 49 6.825,-0.75; 50 6.825,-0.25; 51 6.825,0.25; 52 6.825,0.75; 53 6.825,1.25; 54 6.825,1.75; 55 6.825,2.25; 56 6.825,2.75; 57 6.825,3.25; 58 6.825,3.75; 59 6.825,4.25; 60 6.825,4.75 | smd 0.3 x 1.35: 21 -4.75,-6.825; 22 -4.25,-6.825; 23 -3.75,-6.825; 24 -3.25,-6.825; 25 -2.75,-6.825; 26 -2.25,-6.825; 27 -1.75,-6.825; 28 -1.25,-6.825; 29 -0.75,-6.825; 30 -0.25,-6.825; 31 0.25,-6.825; 32 0.75,-6.825; 33 1.25,-6.825; 34 1.75,-6.825; 35 2.25,-6.825; 36 2.75,-6.825; 37 3.25,-6.825; 38 3.75,-6.825; 39 4.25,-6.825; 40 4.75,-6.825; 61 4.75,6.825; 62 4.25,6.825; 63 3.75,6.825; 64 3.25,6.825; 65 2.75,6.825; 66 2.25,6.825; 67 1.75,6.825; 68 1.25,6.825; 69 0.75,6.825; 70 0.25,6.825; 71 -0.25,6.825; 72 -0.75,6.825; 73 -1.25,6.825; 74 -1.75,6.825; 75 -2.25,6.825; 76 -2.75,6.825; 77 -3.25,6.825; 78 -3.75,6.825; 79 -4.25,6.825; 80 -4.75,6.825
CRYSTAL-SMD-3.2X2.5MM = smd 1.2 x 1.1: 1 -1.175,-0.875; 2 1.175,-0.875; 3 1.175,0.875; 4 -1.175,0.875
CRYSTAL-3.2X1.5 = smd 1.1 x 1.9: P$1 -1.25,0; P$2 1.25,0
CRYSTAL-3.2X2.5 = smd 1.5 x 2.7: 1 -0.95,0; 2 0.95,0

### Placement (x,y rotation side)
C1  18.41,24.13 270 top
C2  15.24,22.86 0 bottom
C3  15.24,25.4 180 bottom
C4  11.43,25.4 180 bottom
C5  17.14,17.14 90 top
C6  11.43,20.32 180 bottom
C7  22.23,17.14 270 top
C8  28.57,39.37 90 bottom
C9  1.27,22.23 270 top
C10  1.27,22.23 270 bottom
C11  1.91,6.35 270 bottom
C12  1.91,10.16 90 top
C13  8.26,8.26 90 top
C14  31.11,29.21 90 top
C15  31.11,29.21 90 bottom
C16  22.86,21.59 90 top
C17  22.86,21.59 90 bottom
C18  21.59,24.77 180 top
C19  21.59,24.77 0 bottom
C20  29.21,29.21 90 top
C21  29.21,29.21 90 bottom
C22  32.38,26.67 180 bottom
C23  32.38,26.67 0 top
C24  33.02,22.86 180 bottom
C25  26.67,28.57 0 bottom
C26  26.67,28.57 0 top
C27  33.02,24.77 180 bottom
C28  24.13,29.21 270 top
C29  24.13,29.21 90 bottom
C30  26.67,30.48 0 bottom
C31  21.59,30.48 0 bottom
C32  21.59,28.57 0 top
C33  21.59,28.57 0 bottom
C34  19.05,29.21 270 top
C35  19.05,29.21 270 bottom
C36  7.62,29.21 90 top
C37  10.79,29.21 90 top
C38  1.91,26.67 270 top
C39  5.08,29.21 90 top
C40  24.13,17.14 90 top
C41  33.02,5.71 270 bottom
C42  33.02,8.89 270 bottom
C43  34.92,5.71 270 bottom
C44  34.92,8.89 270 bottom
C45  26.67,6.35 0 bottom
C46  20.95,10.16 180 top
C47  20.95,12.06 180 top
C48  30.48,12.7 180 bottom
C49  30.48,14.61 180 bottom
C50  34.42,2.24 180 bottom
D1  19.68,4.45 180 top
D2  19.68,6.35 180 top
D3  19.68,8.26 180 top
J1  12.7,2.54 90 top
J2  10.16,20.32 90 top
J3  17.78,20.95 0 top
J4  16.51,30.48 180 top
J5  16.51,27.94 180 top
L1  26.67,30.48 0 top
L2  21.59,30.48 0 top
R1  9.35,22.68 270 bottom
R2  7.87,22.68 90 bottom
R3  29,41 180 top
R4  17,41 180 top
R5  23,41 0 top
R6  11,41 0 top
R7  27.94,35.26 180 bottom
R8  27.94,36.83 180 bottom
R9  5.08,19.68 270 top
R10  5.08,13.34 90 top
R11  1.27,15.88 270 bottom
R12  1.91,10.16 270 bottom
R13  29.64,22.2 270 bottom
R14  1.91,30.48 90 top
R15  19.68,4.45 0 bottom
R16  19.68,6.35 0 bottom
R17  19.68,8.26 0 bottom
R18  26.67,4.45 180 bottom
R19  19.68,35.56 270 bottom
R20  13.97,35.56 90 bottom
U1  15.24,24.13 180 top
U2  11.43,22.86 0 bottom
U3  19.68,17.14 0 top
U4  32.38,37.47 0 bottom
U5  4.45,19.05 270 bottom
U6  5.08,8.26 270 top
U7  27.3,23.5 180 top
U8  26.67,17.78 180 top
U9  31.11,8.89 90 top
Y1  33.02,24.13 180 top
Y2  30.12,5.54 270 bottom
Y3  20.95,11.43 0 bottom

### Tracks (layer width: path | path; a pad name or v marks a point on that pad's centre or on a via)
5V  (via drill 0.25)
  Top 0.203: J1.P$6 10.16,15.98 v10.16,16.51 | v10.16,17.78 10.16,18.26 8.36,20.06 J2.P$2 8.2,22.86
  Top 0.254: J2.P$2 7.62,22.86 | 10.16,15.24 J1.P$6
  Bottom 0.203: v10.16,16.51 v10.16,17.78
ANT  (via drill 0.35)
  Top 0.203: v19.05,31.11 C35.1 19.47,30.48 L2.1 C32.1
  Top 0.254: J4.1 18.63,30.48 C35.1
  Bottom 0.203: v19.05,31.11 C35.1 19.47,30.48 L2.1
BRIDGE_VCC  (via drill 0.25)
  Top 0.203: v38.63,17.14 36.11,17.14 35.37,16.4 U9.42 | v35.56,40.64 v30.91,40.64 | v30.91,40.64 21.67,40.64 21.09,40.07 R5.1 | R3.8 v30.91,40.63 v30.91,40.64
  Bottom 0.203: v35.56,40.64 38.1,40.64 38.73,40.01 38.73,17.14 v38.63,17.14
CHG_STAT  (via drill 0.25, 0.65)  (1 unrouted)
  Top 0.203: U9.53 29.86,16.94 v29.69,17.11 | v14.45,19.36 14.1,19 10.41,19 9.4,20.02 v9.4,20.8
  Bottom 0.203: U2.3 9.44,21.92 R1.2 9.4,21.78 v9.4,20.8
COMMS_EN  (via drill 0.25, 0.35)
  Top 0.203: U9.44 v34.37,17.14 | v34.47,20.42 33.02,20.42 30.73,22.71 v30.73,22.89 30.37,23.25 U7.28
  Bottom 0.203: v34.47,20.42 35.33,19.56 35.33,18.03 34.44,17.14 v34.37,17.14 | v30.73,22.89 30.57,23.05 R13.1
COMMS_IRQ  (via drill 0.65)  (1 unrouted)
  Top 0.203: U7.13 21.51,23.25 v21.34,23.42 | U9.21 37.94,1.43 v38.4,0.97
COMMS_SS  (via drill 0.25)
  Top 0.203: U7.21 27.55,19.71 27.38,19.53 25.65,19.53 v25.3,19.18 | U9.60 26.2,15.88 v25.4,15.88
  Bottom 0.203: v25.4,15.88 25.3,15.98 v25.3,19.18
D1
  Top 0.203: D1.A 21.59,5.47 21.59,6.35 22.38,7.14 U9.74
D2
  Top 0.203: D2.A 21.85,7.64 U9.73
D3
  Top 0.203: D3.A 20.68,8.14 U9.72
GND  (via drill 0.25, 0.35)
  Top 0.152: v19.05,27.3 C34.2 | U7.15 v23.95,22.25 23.05,22.25 C17.2 | C39.P$1 5.08,28.63 v4.06,29.64 | Y1.2 32.62,25.78 33.05,25.78 33.23,25.97 C22.2
  Top 0.203: C21.2 v29.21,31.11 | U7.29 27.55,23.75 U7.EP | C15.2 v31.11,31.11 | v8.26,36.2 arc-90 6.99,34.92 4.45,34.92 arc-90 3.81,35.56 3.81,45.72 arc-90 4.45,46.35 35.56,46.35 arc-90 36.2,45.72 36.2,34.92 arc-90 35.56,34.29 3.81,34.29 arc-90 3.17,34.92 3.17,46.35 arc-90 3.81,46.99 36.2,46.99 arc-90 36.83,46.35 36.83,34.29 arc-90 36.2,33.66 3.17,33.66 arc-90 2.54,34.29 2.54,46.99 arc-90 3.17,47.62 36.83,47.62 arc-90 37.47,46.99 37.47,33.66 arc-90 36.83,33.02 3.17,33.02 arc-90 1.91,34.29 1.91,47.62 arc-90 2.54,48.26 37.47,48.26 arc-90 38.1,47.62 38.1,33.02 arc-90 37.47,32.38 arc90 37.42,32.43 7.89,32.43 arc90 7.21,31.75 7.21,31.76 7.21,31.85 | v23.8,25.22 24.28,24.75 U7.10 24.82,24.77 26.05,24.77 | C19.2 20.74,25.82 v20.95,26.04 | U1.2 15.24,26.67 J5.2 | C1.2 20.32,21.38 J3.2 | C22.2 v33.25,27.69 | J1.P$7 v12.06,17.78 | C5.1 16.09,16.3 v16.08,16.28 | U3.2 19.68,16.51 v20.32,17.14 20.64,17.46 U3.4 21.42,19.23 v21.82,19.23 22.23,18.82 C7.1 | C9.1 1.91,23.71 C38.2 | U6.2 v4.72,8.26 | C13.1 7.62,6.77 v7.62,6.35 | U8.4 27.26,18.53 v27.23,18.57 | U9.49 31.86,16.5 v31.57,16.8 | R14.2 3.06,31.33 v3.1,31.29 | U7.EP 27.3,24.13 26.55,24.88 U7.6 26.55,26.84 v26.31,27.08 26.05,26.82 U7.7 26.05,24.77 | 26.05,24.77 26.05,24.64 26.11,24.59 | 26.29,22.48 25.55,21.75 U7.17 | 26.29,22.48 U7.EP | U7.EP 28.42,22.38 | C40.2 v24.13,19.05 | v37.97,19.74 37.97,20.3 v35.99,22.28 | v35.23,23.39 34.19,23.39 34.2,23.39 Y1.4 | U9.61 v23.11,13.64 | v23.11,13.64 | U9.19 35.37,3.33 v36.02,3.98 | U7.15 25.27,22.25 25.5,22.48 26.29,22.48 | U9.68 25.42,10.14 v26.04,9.53 | C46.2 18.41,10.16 v17.37,11.2 18.24,12.06 C47.2
  Top 0.254: U9.14 32.87,2.97 v33.15,3.25
  Bottom 0.152: C34.2 v19.05,27.3
  Bottom 0.203: v29.21,31.11 C21.2 | v31.11,31.11 C15.2 | v8.26,36.2 8.26,31.75 | C24.2 33.68,22.67 | U5.13 3.47,18.07 | U5.12 3.47,18.07 | 3.47,18.07 U5.EXP | U5.EXP 4.77,19.38 U5.6 | U5.EXP 4.77,18.73 U5.7 | U5.EXP 2.54,20.95 | U5.EXP 6.35,20.95 | U5.EXP 5.42,18.07 U5.8 | U5.EXP 2.54,17.14 | C8.2 29.63,40.22 U4.EXP 34.29,35.56 34.29,31.75 | 28.22,7.62 27.94,7.62 | R19.2 16.82,35.56 v16.79,35.53 | R20.2 15.64,35.53 v16.79,35.53 | v16.79,35.53 16.79,32.03 16.51,31.75
  Bottom 0.254: C45.1 27.52,7.2 27.94,7.62 | U4.EXP 32.06,37.79 U4.11
  pour Bottom (isolate 0.127): 39.37,0 39.37,31.75 0,31.75 0,0
MEM_SS
  Top 0.203: U8.1 28.54,17.03 28.86,16.7 U9.55
MISO  (via drill 0.25)
  Top 0.203: 28.6,20.95 U7.23 28.55,19.75 v28.36,19.56 | v36.2,18.52 v34.65,18.52 | U8.2 28.58,17.53 29.1,18.05 v29.1,18.86 29.68,18.86 30.79,17.75 v32.87,17.75 U9.47
  Bottom 0.203: v28.36,19.56 29.07,18.86 v29.1,18.86 | U4.2 37.14,37.79 37.47,37.47 37.47,21.59 36.2,20.32 v36.2,18.52 | v34.65,18.52 34.42,18.52 33.66,17.75 v32.87,17.75
MOSI  (via drill 0.25)
  Top 0.203: U8.5 25.52,18.53 26.04,19.05 26.99,19.05 27.02,19.07 27.44,19.07 27.46,19.05 28.57,19.05 29.05,19.53 | 29.05,19.53 U7.24 | 29.05,19.53 30.43,19.53 31.57,18.39 33.6,18.39 | U9.46 33.37,16.78 33.6,17.02 33.6,18.39 | 33.6,18.39 v33.58,18.41 | v35.92,20.98 34.62,19.68 v33.58,19.68
  Bottom 0.203: U4.3 36.52,37.14 36.83,36.83 36.83,21.89 v35.92,20.98 | v33.58,19.68 v33.58,18.41
N$1  (via drill 0.25)
  Top 0.203: v17.78,6.99 18.17,6.99 D2.C
  Bottom 0.203: R16.2 18.2,6.99 v17.78,6.99
N$2  (via drill 0.25)
  Top 0.203: v15.9,21.89 16.19,22.18 U1.5
  Bottom 0.203: C2.1 16.09,22.08 v15.9,21.89
N$3  (via drill 0.25)
  Top 0.203: U1.4 14.29,22.18 v14.55,21.92
  Bottom 0.203: v14.55,21.92 14.39,22.08 C2.2
N$4  (via drill 0.25)
  Top 0.203: U7.30 30.36,24.25 31.36,23.25 Y1.3 31.84,22.38 v32.28,21.95
  Bottom 0.203: 32.24,22.86 C24.1 | v32.28,21.95 32.17,22.06 32.17,22.99
  Bottom 0.254: 32.17,22.99 C24.1
N$5  (via drill 0.25)
  Top 0.203: R4.8 18.91,36.98 v20.32,35.56
  Bottom 0.203: v20.32,35.56 21.29,34.59 R19.1
N$6
  Bottom 0.203: R7.2 30.02,36.49 U4.9
N$7  (via drill 0.25)
  Top 0.203: 9.1,38.12 R6.1 v9.09,40.03
  Bottom 0.203: R20.1 9.09,39.84 v9.09,40.03
N$8  (via drill 0.25)
  Top 0.203: C19.1 22.96,24.25 v23.5,24.25 U7.11
  Bottom 0.203: C19.1 22.96,24.25 v23.5,24.25
N$9  (via drill 0.25)
  Top 0.203: U7.3 U7.4 27.55,26.92 v27.94,27.3 28.16,27.3 C21.1
  Bottom 0.203: C21.1 28.16,27.3 v27.94,27.3
N$10  (via drill 0.25)
  Top 0.203: U7.31 29.82,24.77 30.48,24.77 31.11,24.13 33.32,24.13 Y1.1 34.2,25.79 v34.52,26.11
  Bottom 0.203: v34.52,26.11 33.87,25.46 C27.2
N$11  (via drill 0.25)
  Top 0.203: U7.1 29.05,26.36 29.36,26.67 C23.1 30.79,25.92 v30.79,25.27
  Bottom 0.203: v30.79,25.27 30.79,25.92 C23.1
N$12  (via drill 0.25)
  Top 0.203: C25.2 26.04,28.36 | U7.5 27.05,27.34 C25.2 | C25.2 v25.82,29.5 v25.81,29.52
  Bottom 0.203: 26.04,28.36 C25.2 v25.82,29.5 v25.81,29.52
N$13  (via drill 0.25)
  Top 0.203: C31.1 23.07,31.11 v24.13,31.11 | 24.55,30.48 C28.1 v24.13,31.11 | v24.13,31.11 25.18,31.11 L1.1
  Bottom 0.203: C31.1 23.07,31.11 v24.13,31.11 25.18,31.11 L1.1
N$14  (via drill 0.25)
  Top 0.203: C29.1 v24.13,27.3 24.77,27.3 25.55,26.52 U7.8
  Bottom 0.203: v24.13,27.3 C29.1
N$15  (via drill 0.25)
  Top 0.203: L1.2 27.52,29.58 27.53,29.57 v27.51,29.54 27.52,29.53 C26.2
  Bottom 0.203: v27.51,29.54 27.51,28.59 C26.2
N$16  (via drill 0.25)
  Top 0.203: C32.2 22.86,28.16 v22.86,27.3 24.8,25.36 U7.9
  Bottom 0.203: v22.86,27.3 22.86,28.16 C32.2
N$17  (via drill 0.25)
  Top 0.203: R10.1 5.35,14.34 v4.45,15.24
  Bottom 0.203: v4.45,15.24 4.77,15.56 U5.10
N$18  (via drill 0.25)
  Top 0.203: R3.1 30.91,42.34 30.48,41.91 v19.68,41.91 18.91,42.69 R4.1 | v5.08,22.86 5.08,25.09 6.18,26.2 6.25,26.26 6.63,26.64 6.63,29.13 v7.16,29.67
  Bottom 0.203: U5.4 5.42,22.52 v5.08,22.86 | v7.16,29.67 6.73,30.1 6.73,40.49 8.79,42.55 19.05,42.55 v19.68,41.91
N$19  (via drill 0.25)
  Top 0.203: U6.1 3.52,9.21 v2.85,8.53
  Bottom 0.203: C11.1 R12.2 2.68,8.53 v2.85,8.53
N$20
  Top 0.203: C37.2 10.46,30.81 C36.P$2 | C38.1 R14.1 2.75,30.48 3.61,30.48 3.94,30.81 C39.P$2 C36.P$2 | 7.64,30.79 C36.P$2
N$21  (via drill 0.25)
  Top 0.203: U6.4 U6.3 2.22,7.3 1.91,7.62 C12.1 3.17,10.58 3.17,11.17 4.26,12.25 4.43,12.43 5.08,13.08 v5.08,13.34
  Bottom 0.203: U5.9 5.42,13.68 v5.08,13.34
N$22  (via drill 0.25)
  Top 0.203: R9.1 4.45,19.65 4.45,21.59 4.12,21.92 v4.12,22
  Bottom 0.203: v4.12,22 U5.2
N$23  (via drill 0.25)
  Top 0.203: R10.2 3.43,15.49 v3.81,15.88
  Bottom 0.203: v3.81,15.88 4.12,16.18 U5.11
N$25
  Top 0.203: J4.2 11.43,27.94 C37.1 10.46,27.61 C36.P$1
N$26
  Bottom 0.203: R8.2 29.1,37.14 U4.10
N$27  (via drill 0.25)
  Top 0.203: R9.2 4.85,21.56 v4.85,22
  Bottom 0.203: v4.85,22 4.77,21.91 U5.3
N$28  (via drill 0.25)
  Top 0.203: U9.69 23.3,9.64 23.14,9.8 23.14,11.84 22.76,12.22 21.96,12.22 C47.1 20.86,11.12 v18.75,11.12
  Bottom 0.203: v18.75,11.12 19.7,11.12 Y3.2
N$29  (via drill 0.25)
  Top 0.203: v3.81,22.86 3.81,24.66 5.99,26.85 5.99,29.16 v5.51,29.64 | v8.13,43.36 v8.14,43.35 R6.8 | v20.09,43.36 v20.1,43.35 R5.8
  Bottom 0.203: U5.1 3.47,22.52 v3.81,22.86 | v20.09,43.36 v8.13,43.36 5.97,41.2 5.97,30.1 v5.51,29.64
N$30  (via drill 0.25)
  Top 0.203: U9.70 v22.86,9.14 22.82,9.14 C46.1
  Bottom 0.203: v22.86,9.14 22.86,9.96 21.91,10.91 Y3.1
N$31
  Top 0.203: 7.21,31.75 7.21,31.06
N$32  (via drill 0.35)
  Top 0.203: U9.20 35.87,2.97 36.07,3.17 v36.55,3.17
  Bottom 0.203: v36.55,3.17 36.55,2.69 36.09,2.23 C50.2
N$34  (via drill 0.25)
  Top 0.203: D3.C 18.17,8.89 v17.78,8.89
  Bottom 0.203: v17.78,8.89 18.2,8.89 R17.2
N$36  (via drill 0.25)
  Top 0.203: v1.27,12.7 1.91,12.06 C12.2
  Bottom 0.203: C12.2 1.91,12.06 v1.27,12.7 R11.2
N$38  (via drill 0.25)
  Top 0.203: D1.C 18.17,5.08 v17.78,5.08
  Bottom 0.203: v17.78,5.08 18.2,5.08 R15.2
N$39  (via drill 0.25)
  Bottom 0.203: 10.86,23.77 U2.4 10.59,23.8 8.97,25.43 8,25.43 7.77,25.2 v7.77,24.69 7.77,23.63 R2.2
N$43
  Bottom 0.203: U5.15 1.49,19.38 0.81,18.69 0.81,17.18 R11.1
RXD  (via drill 0.25)
  Top 0.203: J1.P$4 10.9,8.15 13.34,5.71 v13.34,3.81 | v38.1,15.24 37.62,15.71 U9.41
  Bottom 0.203: v13.34,3.81 16.51,0.64 36.2,0.64 38.73,3.17 38.73,14.61 v38.1,15.24
SBWTCK  (via drill 0.25)
  Top 0.203: J1.P$1 23.7,2.54 v24.49,3.33 | v25.55,7.62 25.55,8.46 25.38,8.64 U9.71
  Bottom 0.203: v24.49,3.33 24.49,7.34 24.77,7.62 v25.55,7.62
SBWTDIO  (via drill 0.25)
  Top 0.203: U9.76 25.05,6.14 v25.78,5.41 25.78,2.29 24.77,1.27 12.7,1.27 10.9,3.07 J1.P$2
  Bottom 0.203: C45.2 25.82,5.45 v25.78,5.41 25.82,5.37 R18.1
SCK  (via drill 0.25)
  Top 0.203: U7.26 30.41,22.25 32.04,20.61 | 32.05,20.6 32.04,20.61 | 32.04,20.61 32.04,19.11 v32.05,19.1 32.06,19.09 | 32.06,19.09 36.24,19.09 v36.83,19.68 | 32.38,15.73 U9.48 32.37,17.11 v32.23,17.25 | 32.05,19.08 32.06,19.09 | U8.6 25.85,18.03 v26.11,18.29
  Bottom 0.203: U4.1 37.76,38.44 38.1,38.1 38.1,20.95 v36.83,19.68 | v32.23,17.25 32.05,17.42 v32.05,19.1 30.53,19.1 29.46,18.03 26.36,18.03 v26.11,18.29
SENSOR_OUT  (via drill 0.25)
  Top 0.203: 12.18,11.43 12.06,11.43
  Top 0.254: U9.80 23.19,4.14 22.23,3.17 17.14,3.17 16.51,3.81 16.51,8.89 13.97,11.43 12.18,11.43 | v7.62,15.88 6.35,15.88 5.51,16.71 2.44,16.71 v1.4,17.75 | v8.89,15.24 8.89,14.61 12.06,11.43
  Bottom 0.254: v7.62,15.88 8.26,15.88 v8.89,15.24 | v1.4,17.75 1.4,18.34 1.78,18.73 U5.14
TEMP_SS  (via drill 0.25)
  Top 0.203: v36.2,31.11 38.73,28.57 38.73,18.41 38.1,17.78 35.97,17.78 34.87,16.68 U9.43
  Bottom 0.203: U4.4 35.9,36.49 36.2,36.2 v36.2,31.11
TXD  (via drill 0.25)
  Top 0.203: J1.P$3 14.5,3.92 v14.61,3.81 | v37.47,14.61 37.94,14.13 U9.40
  Bottom 0.203: v14.61,3.81 17.14,1.27 36.2,1.27 38.1,3.17 38.1,13.97 v37.47,14.61
VBAT  (via drill 0.25, 0.65)  (1 unrouted)
  Top 0.203: J2.P$1 12.7,20.32 | v12.7,21.59 12.7,20.32 | J3.1 17.14,20.32 C5.2 16.13,19.01 v16.13,19.68 | J3.1 15.88,20.95 15.24,20.32 12.7,20.32 | J3.1 18.73,20 U3.5 U3.1 | U9.77 23.24,5.64 v22.71,6.17
  Bottom 0.203: U2.1 12.37,21.92 v12.7,21.59 12.7,20.74 C6.2
VCC  (via drill 0.25)
  Top 0.203: U7.2 28.55,26.65 29.21,27.3 v30.05,27.3 v30.06,27.3 C15.1 31.33,28.57 v32.38,28.57 | C7.2 21.79,15.86 U3.3 20.64,15.55 19.68,14.61 16.51,14.61 14.61,16.51 11.43,16.51 10.79,17.14 v8.89,17.14 | v31.33,13.64 31.33,15.68 U9.50 | U6.5 8.15,9.21 C13.2 8.26,15.88 8.89,16.51 v8.89,17.14 | U9.11 31.36,2.82 v30.94,3.25 | U8.8 25.34,16.61 25.04,16.31 24.14,16.31 C40.1 v23.16,16.3 | 24.13,14.61 22.86,14.61 22.23,15.24 C7.2 | v23.16,16.3 C7.2 | 29.84,21.7 U7.25 30.25,21.75 30.56,21.44 v30.56,20.32 | v23.16,16.3 23.16,19.15 23.9,19.89 26.7,19.89 v26.85,20.04 26.55,20.33 U7.19 U7.18 | C10.2 v1.27,20.09 1.27,18.97 2.9,17.35 6.48,17.35 6.68,17.14 v8.89,17.14 | v33.2,21.01 33.83,21.01 35.84,23.01 35.84,26.85 34.11,28.57 v32.38,28.57 | v32.11,31.47 32.38,31.19 v32.38,28.57 | v8.89,17.14 8.89,18.41 v8.26,19.05 | U8.8 U8.7 | v27.24,17.14 27.24,17.63 27.64,18.03 U8.3 | U8.8 25.92,17.03 v26.04,17.14
  Top 0.254: U9.18 34.87,3.65 v36.04,4.83 v36.04,8.03 36.09,8.08 | v33.68,3.81 33.68,7.72 v33.96,8 33.96,11.01 v31.33,13.64 26.36,13.64 25.4,14.61 24.13,14.61 23.91,14.61
  Bottom 0.203: v30.05,27.3 C15.1 | C49.2 v31.33,13.64 C48.2 | C41.2 32.16,4 32.16,3.83 31.57,3.25 v30.94,3.25 | 28.66,38.44 U4.12 | v26.85,20.04 27.13,20.32 v30.56,20.32 32.51,20.32 v33.2,21.01 | v8.26,19.05 7.28,20.02 U5.5 | U5.16 1.34,20.02 v1.27,20.09 C10.2 | C8.1 27.73,38.52 27.09,37.88 R8.1 R7.1 28.39,33.96 29.62,33.96 v32.11,31.47 | v26.04,17.14 v27.24,17.14
  Bottom 0.254: v36.04,4.83 34.96,4.83 C43.2 | v36.04,8.03 34.94,8.03 C44.2 34,8.04 v33.96,8 33.92,8.04 C42.2 | 33.02,4.47 C41.2 33.68,4.21 v33.68,3.81 | R18.2 29.43,2.54 30.23,2.54 v30.94,3.25 | C8.1 28.66,38.44
VCHGR  (via drill 0.25)
  Top 0.203: 12.7,25.42 U1.3 14.4,25.31 v14.4,24.43 | 12.7,25.42 11.98,25.42 J2.P$3 | 12.7,25.42 v12.7,24.13 9.17,24.13 v8.64,24.66
  Bottom 0.203: U2.6 12.37,23.8 v12.7,24.13 12.7,24.98 C4.2 | 9.35,24.13 R1.1 9.35,23.95 v8.64,24.66 | C3.1 14.4,25.39 v14.4,24.43
VIN  (via drill 0.25)
  Top 0.152: C17.1 23.07,20.95
  Top 0.203: C17.1 18.62,24.98 C1.1 17.98,25.42 U1.1 | v29.84,26.04 29.84,25.29 U7.32
  Top 0.254: C17.1 v24.34,20.74 24.8,21.2 U7.16
  Bottom 0.203: v24.34,20.74 24.8,20.74 29.84,25.78 v29.84,26.04
  Bottom 0.254: v24.34,20.74 C17.1
XIN  (via drill 0.25)
  Top 0.203: v31.55,4.09 31.88,3.76 31.88,2.05
  Top 0.254: 31.88,2.05 U9.12
  Bottom 0.203: Y2.P$2 31.35,4.29 v31.55,4.09
XOUT  (via drill 0.25)
  Top 0.203: v30.1,5.79 31.04,5.79 32.38,4.45 32.37,4.42 U9.13
  Bottom 0.203: Y2.P$1 30.12,5.82 v30.1,5.79

### Text on the board
tPlace: Flow Sensor Senior Design Project | Board V2.0 | R6 | R4 | R5 | R3 | Parallel C | Series C | Ant. Match | Imp. Match | R14 | C37 | L2 | L1 | C34 | C28 | C20 | C14 | C39 | C36 | C32 | C26 | vcc | Battery Charger | C38 | C23 | C1 | C18 | 5V | LTC1517-5 | comms_irq | C9 | 13.56MHz | C16 | Regulator | chg_stat | vbat | _ | RMC25C256C | TRF7970A | vcc | + | GND | chg_stat | R9 | C5 | C7 | C40 | GAIN2 | DANGER--> | remove battery | 5V | MAX1726 | GAIN1 | 3V3 | C47 | R10 | RXD | C46 | C12 | C13 | TXD | D3 | LM321 | SBWTDIO | D2 | vbat | SBWTCK | D1 | trudy was here | MSP430F5529 | comms_irq
bPlace: C30 | C31 | C35 | C33 | C29 | C25 | C21 | C15 | C22 | C4 | C3 | C19 | C27 | C2 | C10 | R2 | R1 | XC6805 | C17 | R13 | C24 | C6 | AD8222 | R11 | C49 | C48 | 8MHz | R12 | R17 | C42 | C44 | 32.768kHz | R16 | C45 | C11 | R15 | R18 | C41 | C43